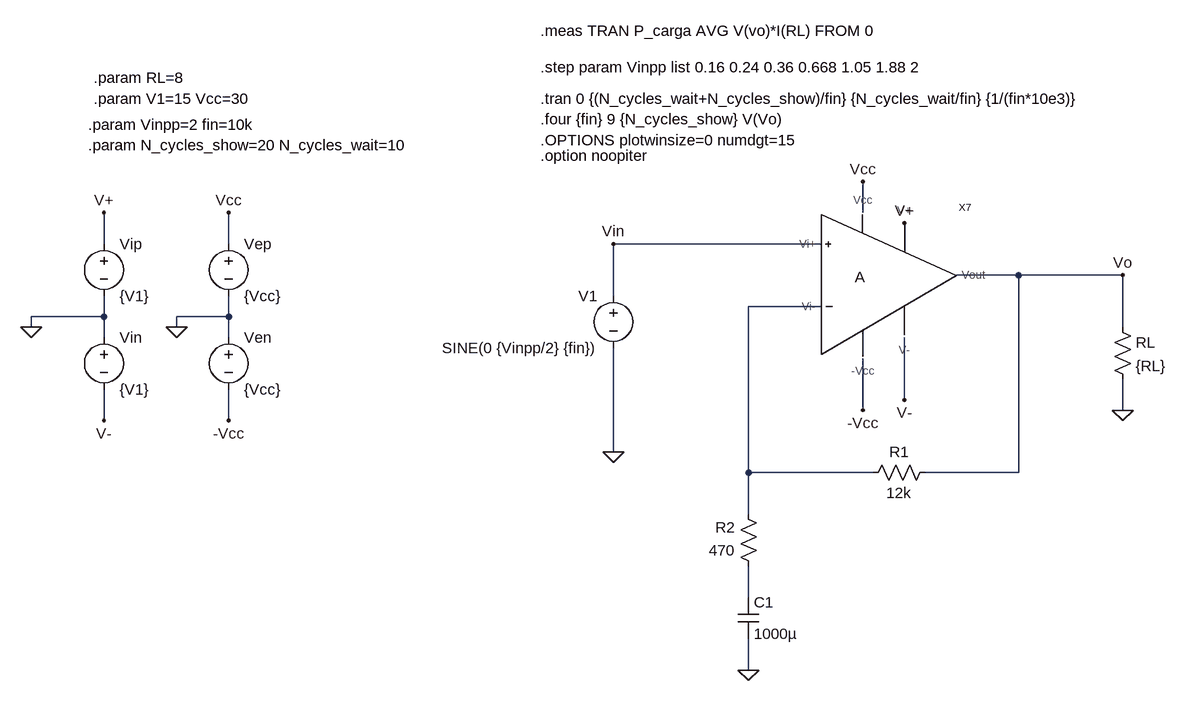
[diagram p0: schematic thd.asc]
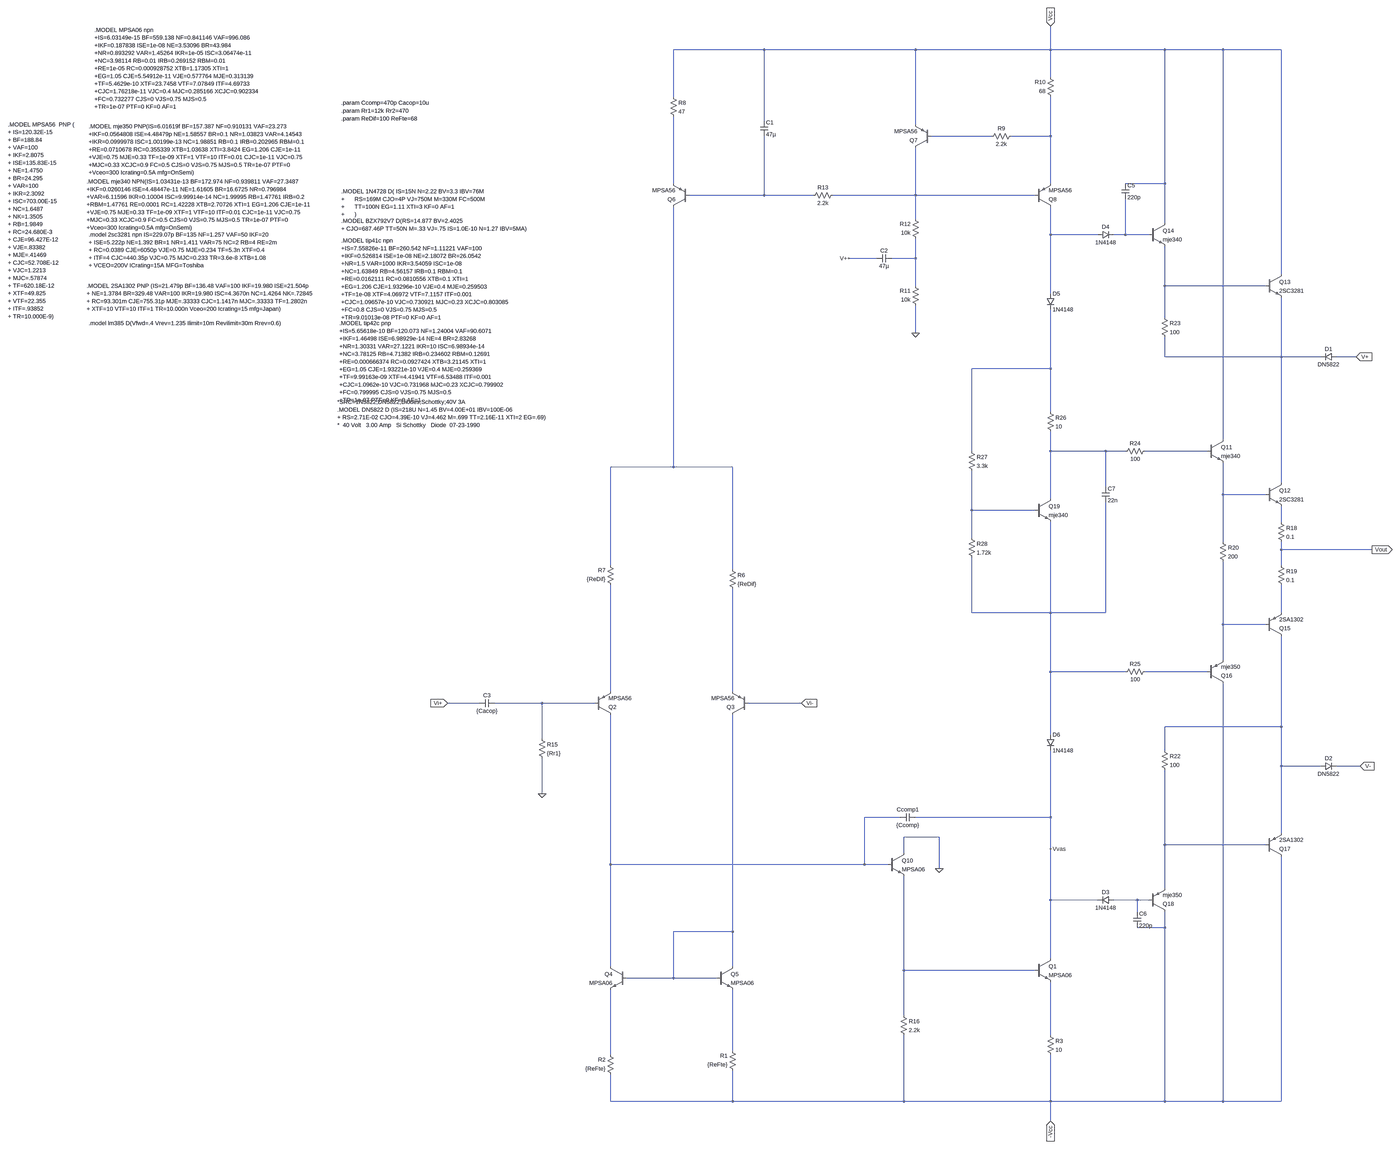
[diagram p1: sub-circuit amplificador.asc, whole sheet]
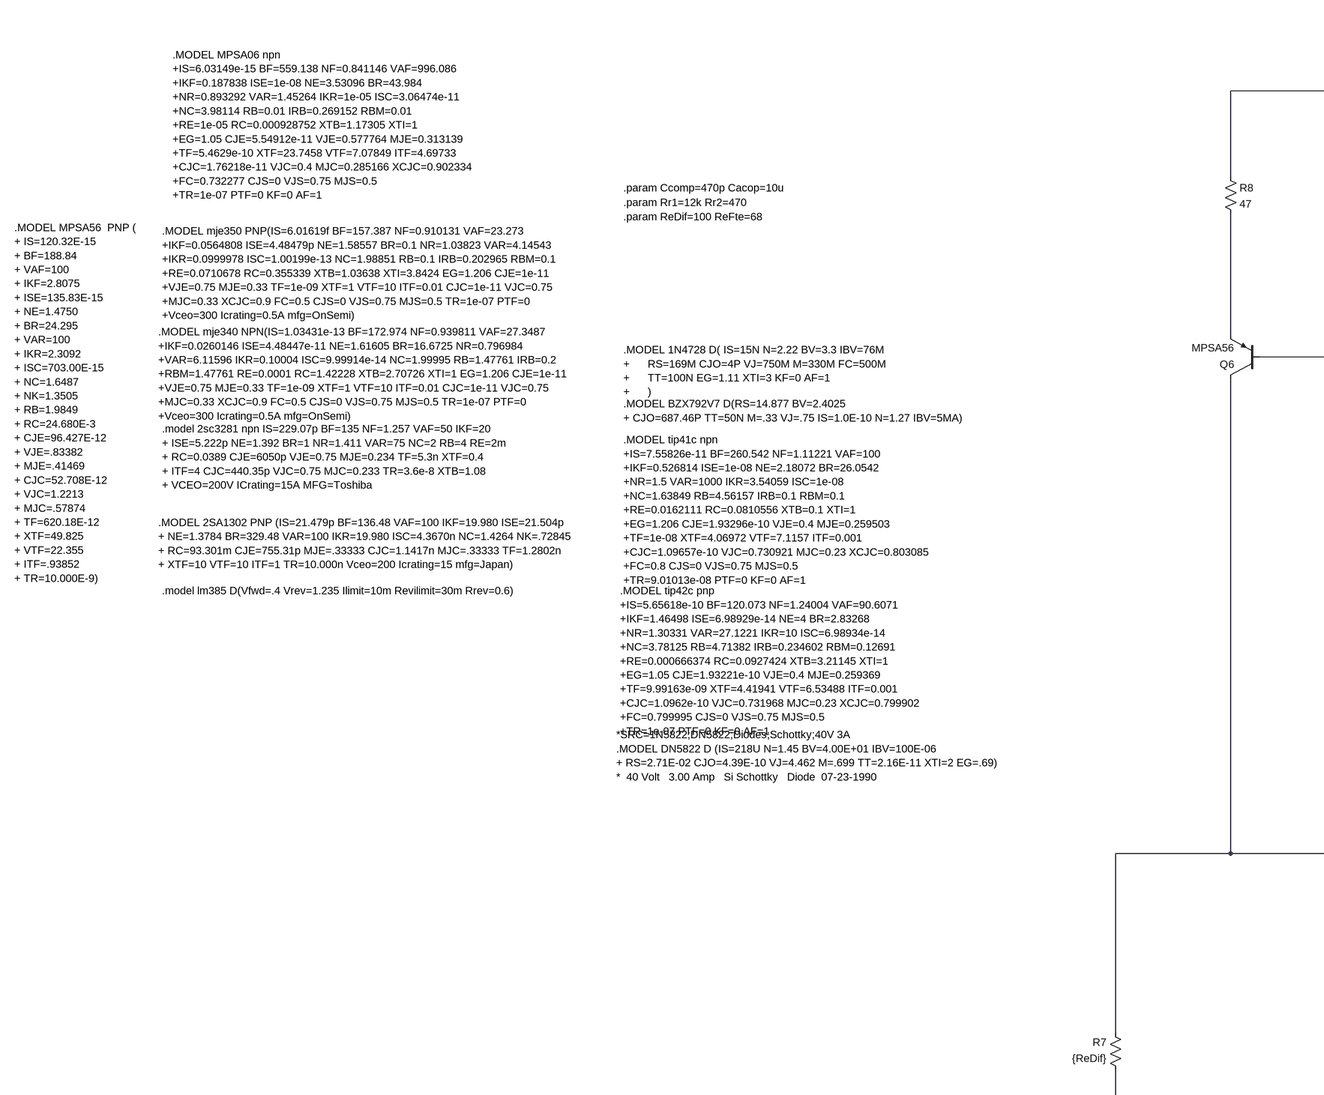
[diagram p2: sub-circuit amplificador.asc, part, row 1 of 2, column 1 of 2]
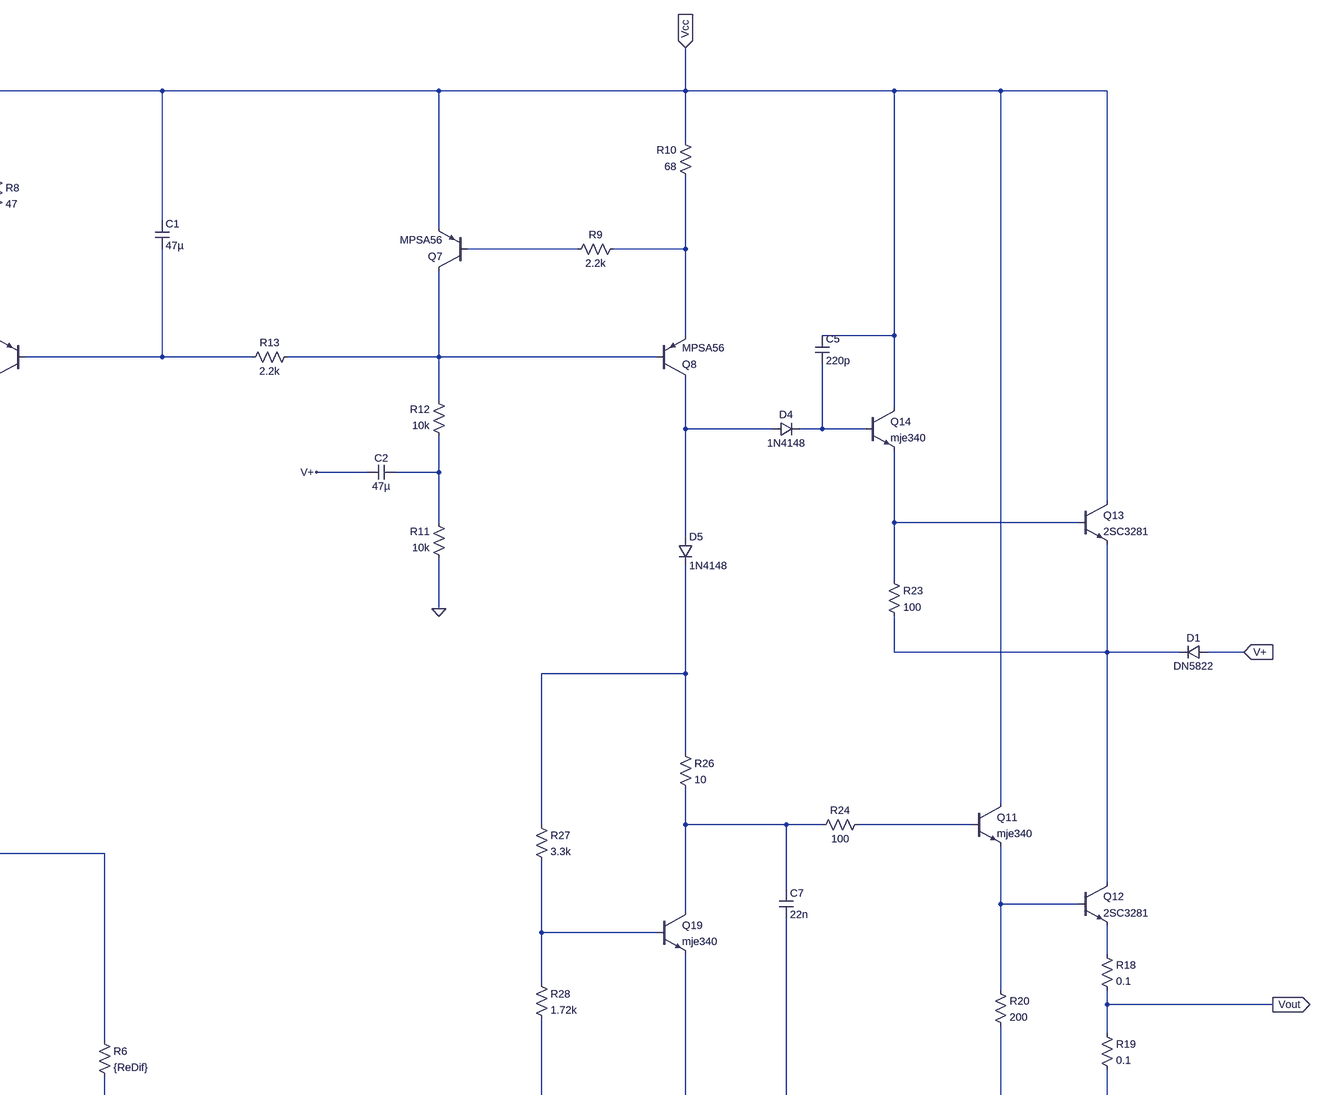
[diagram p3: sub-circuit amplificador.asc, part, row 1 of 2, column 2 of 2]
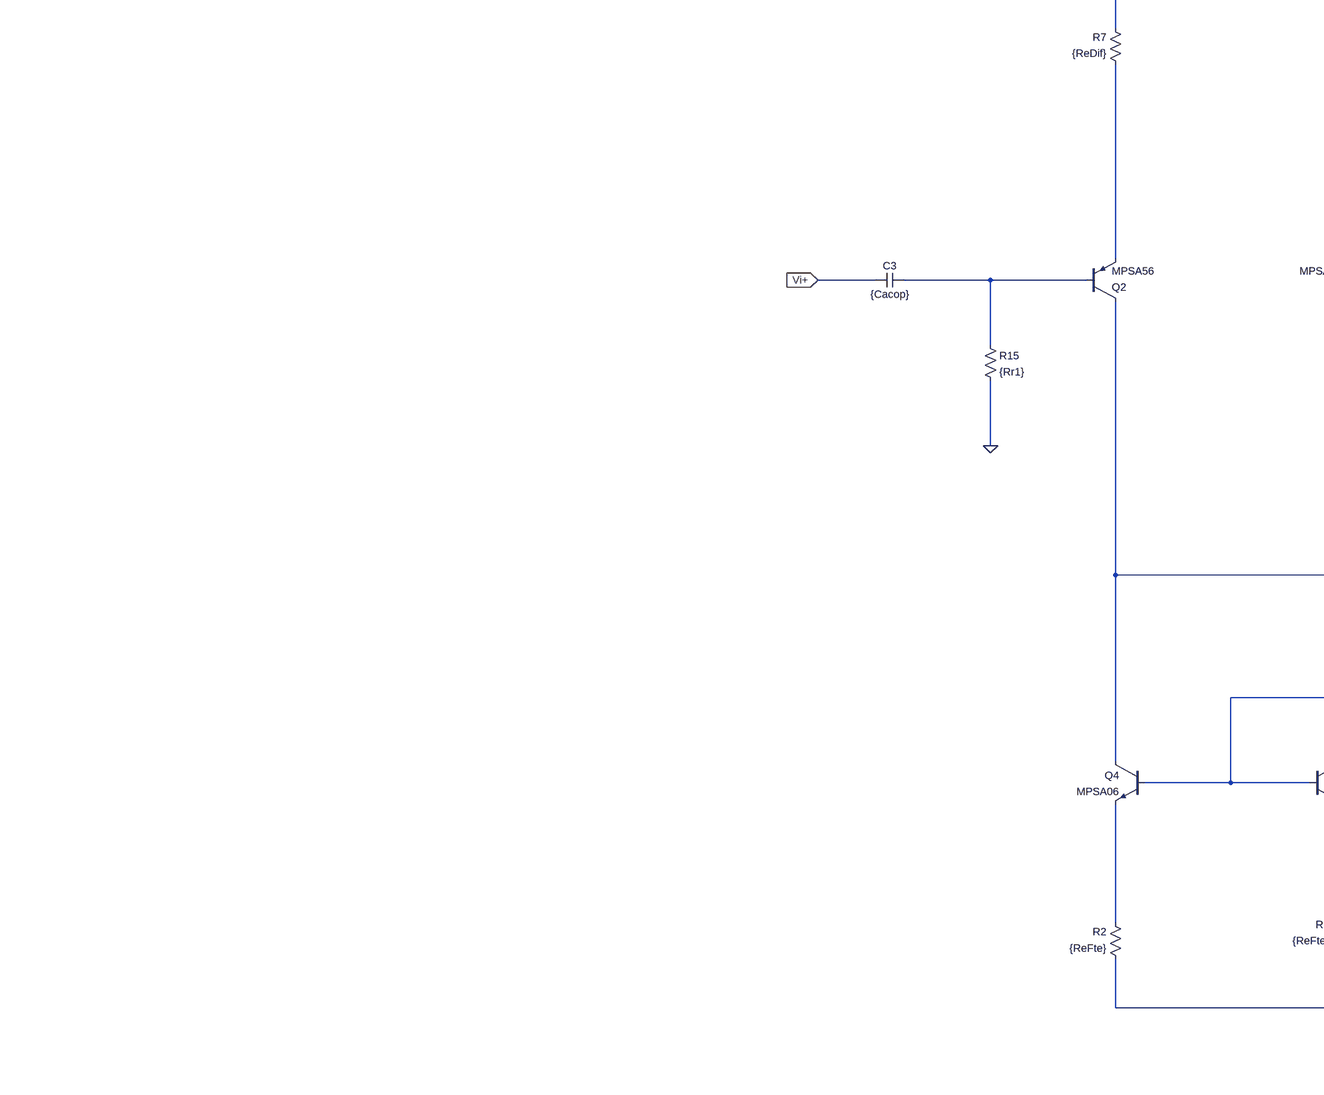
[diagram p4: sub-circuit amplificador.asc, part, row 2 of 2, column 1 of 2]
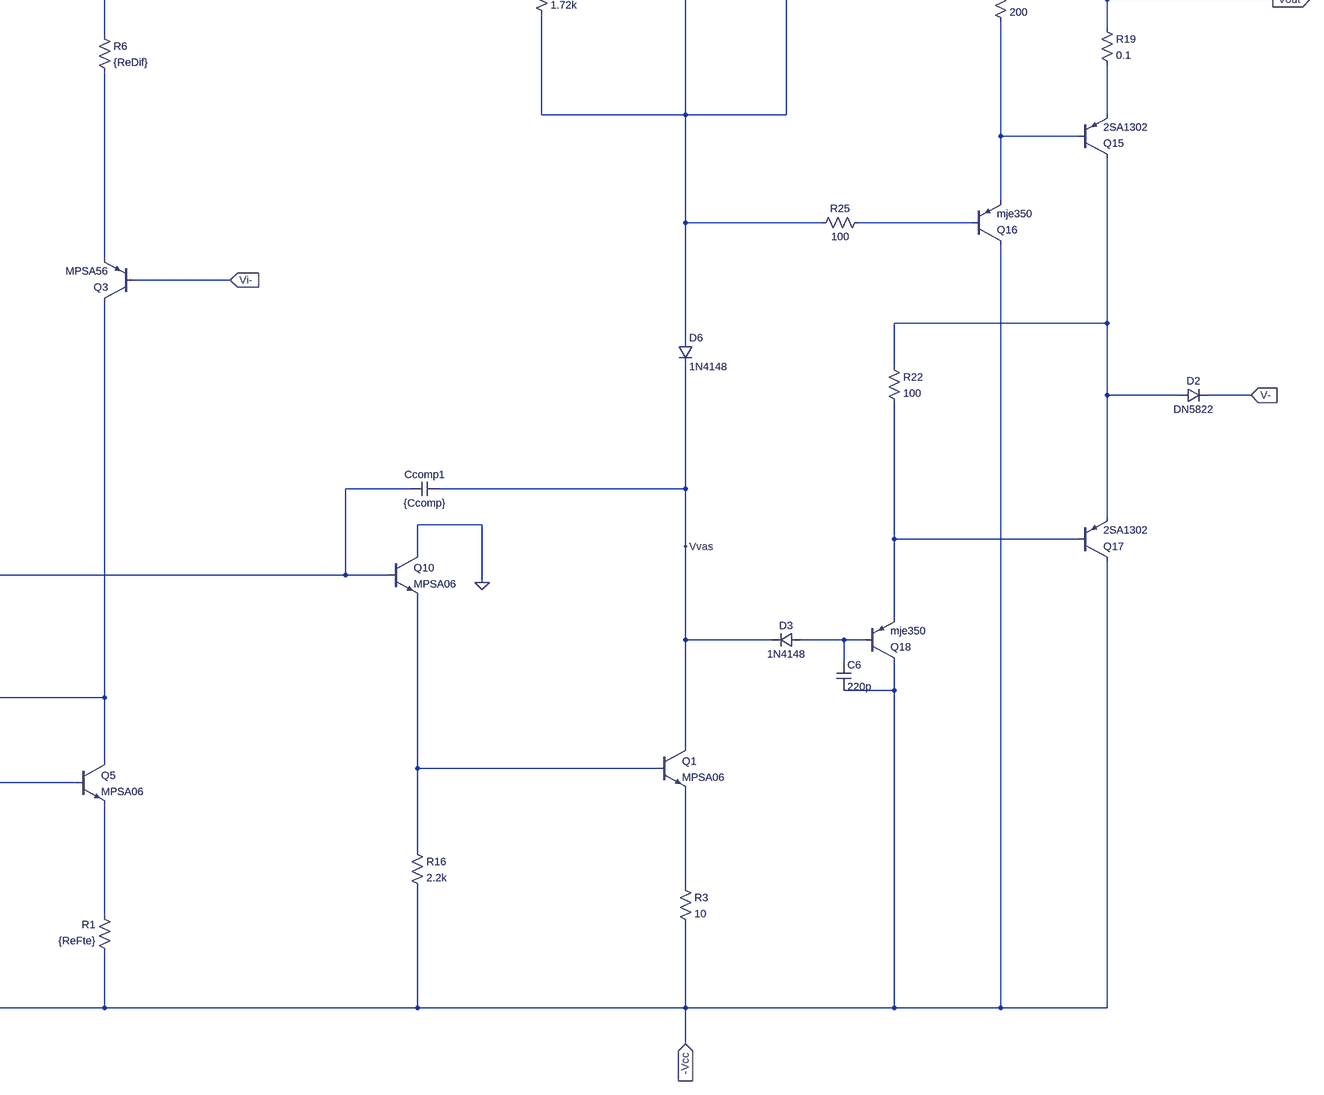
[diagram p5: sub-circuit amplificador.asc, part, row 2 of 2, column 2 of 2]
thd.asc, the LTspice schematic file:
Version 4
SHEET 1 2388 1476
WIRE -256 320 -256 272
WIRE -1424 368 -1424 320
WIRE -1232 368 -1232 320
WIRE -320 368 -640 368
WIRE -16 416 -112 416
WIRE 144 416 -16 416
WIRE -640 448 -640 368
WIRE -320 464 -432 464
WIRE -1424 480 -1424 448
WIRE -1424 480 -1536 480
WIRE -1232 480 -1232 448
WIRE -1232 480 -1312 480
WIRE -1536 496 -1536 480
WIRE -1312 496 -1312 480
WIRE 144 496 144 416
WIRE -1424 512 -1424 480
WIRE -1232 512 -1232 480
WIRE -192 608 -192 512
WIRE -256 624 -256 544
WIRE 144 624 144 576
WIRE -1424 640 -1424 592
WIRE -1232 640 -1232 592
WIRE -640 688 -640 528
WIRE -432 720 -432 464
WIRE -240 720 -432 720
WIRE -16 720 -16 416
WIRE -16 720 -160 720
WIRE -432 784 -432 720
WIRE -432 912 -432 864
WIRE -432 1024 -432 976
FLAG -256 272 Vcc
FLAG -256 624 -Vcc
FLAG -192 608 V-
FLAG -1536 496 0
FLAG -1312 496 0
FLAG -1232 640 -Vcc
FLAG -1232 320 Vcc
FLAG -640 688 0
FLAG -640 368 Vin
FLAG 144 624 0
FLAG -192 336 V+
FLAG -1424 320 V+
FLAG -1424 640 V-
FLAG 144 416 Vo
FLAG -432 1024 0
SYMBOL amplificador -256 416 R0
SYMATTR InstName X7
SYMBOL res -144 704 R90
WINDOW 0 0 56 VBottom 2
WINDOW 3 32 56 VTop 2
SYMATTR InstName R1
SYMATTR Value 12k
SYMBOL res -416 880 R180
WINDOW 0 36 76 Left 2
WINDOW 3 36 40 Left 2
SYMATTR InstName R2
SYMATTR Value 470
SYMBOL voltage -1424 352 R0
WINDOW 123 0 0 Left 2
WINDOW 39 0 0 Left 2
SYMATTR InstName Vip
SYMATTR Value {V1}
SYMBOL voltage -1424 496 R0
WINDOW 123 0 0 Left 2
WINDOW 39 0 0 Left 2
SYMATTR InstName Vin
SYMATTR Value {V1}
SYMBOL voltage -1232 352 R0
WINDOW 123 0 0 Left 2
WINDOW 39 0 0 Left 2
SYMATTR InstName Vep
SYMATTR Value {Vcc}
SYMBOL voltage -1232 496 R0
WINDOW 123 0 0 Left 2
WINDOW 39 0 0 Left 2
SYMATTR InstName Ven
SYMATTR Value {Vcc}
SYMBOL voltage -640 432 M0
WINDOW 123 0 0 Left 2
WINDOW 39 0 0 Left 2
SYMATTR InstName V1
SYMATTR Value SINE(0 {Vinpp/2} {fin})
SYMBOL res 128 480 R0
SYMATTR InstName RL
SYMATTR Value {RL}
SYMBOL cap -448 912 R0
SYMATTR InstName C1
SYMATTR Value 1000µ
TEXT -1448 216 Left 2 !.param N_cycles_show=20 N_cycles_wait=10
TEXT -1448 184 Left 2 !.param Vinpp=2 fin=10k
TEXT -1440 144 Left 2 !.param V1=15 Vcc=30
TEXT -1440 112 Left 2 !.param RL=8
TEXT -752 96 Left 2 !.step param Vinpp list 0.16 0.24 0.36 0.668 1.05 1.88 2
TEXT -752 144 Left 2 !.tran 0 {(N_cycles_wait+N_cycles_show)/fin} {N_cycles_wait/fin} {1/(fin*10e3)}
TEXT -752 176 Left 2 !.four {fin} 9 {N_cycles_show} V(Vo)
TEXT -752 208 Left 2 !.OPTIONS plotwinsize=0 numdgt=15
TEXT -752 232 Left 2 !.option noopiter
TEXT -752 40 Left 2 !.meas TRAN P_carga AVG V(vo)*I(RL) FROM 0

amplificador.asc, the sub-circuit schematic file:
Version 4
SHEET 1 7264 2156
WIRE -1120 -2688 -1488 -2688
WIRE -368 -2688 -1120 -2688
WIRE 192 -2688 192 -2784
WIRE 192 -2688 -368 -2688
WIRE 656 -2688 192 -2688
WIRE 976 -2688 656 -2688
WIRE 1296 -2688 976 -2688
WIRE 192 -2576 192 -2688
WIRE -1488 -2496 -1488 -2688
WIRE -1120 -2400 -1120 -2688
WIRE -368 -2384 -368 -2688
WIRE -48 -2336 -304 -2336
WIRE 192 -2336 192 -2496
WIRE 192 -2336 32 -2336
WIRE -1488 -2144 -1488 -2416
WIRE 192 -2144 192 -2336
WIRE 656 -2144 656 -2688
WIRE 656 -2144 496 -2144
WIRE -1120 -2096 -1120 -2336
WIRE -1120 -2096 -1424 -2096
WIRE -784 -2096 -1120 -2096
WIRE -368 -2096 -368 -2288
WIRE -368 -2096 -704 -2096
WIRE 128 -2096 -368 -2096
WIRE -368 -2000 -368 -2096
WIRE 656 -1984 656 -2144
WIRE 192 -1936 192 -2048
WIRE 384 -1936 192 -1936
WIRE 496 -1936 496 -2080
WIRE 496 -1936 448 -1936
WIRE 592 -1936 496 -1936
WIRE -528 -1840 -640 -1840
WIRE -368 -1840 -368 -1920
WIRE -368 -1840 -464 -1840
WIRE 1296 -1776 1296 -2688
WIRE -368 -1728 -368 -1840
WIRE 656 -1728 656 -1888
WIRE 1232 -1728 656 -1728
WIRE 192 -1696 192 -1936
WIRE 656 -1600 656 -1728
WIRE -368 -1536 -368 -1648
WIRE 656 -1440 656 -1520
WIRE 1296 -1440 1296 -1680
WIRE 1296 -1440 656 -1440
WIRE 1456 -1440 1296 -1440
WIRE 1600 -1440 1520 -1440
WIRE 192 -1392 192 -1632
WIRE 192 -1392 -128 -1392
WIRE 192 -1216 192 -1392
WIRE 976 -1104 976 -2688
WIRE -128 -1056 -128 -1392
WIRE 192 -1056 192 -1136
WIRE 416 -1056 192 -1056
WIRE 496 -1056 416 -1056
WIRE 912 -1056 576 -1056
WIRE -1488 -992 -1488 -2048
WIRE -1488 -992 -1744 -992
WIRE -1248 -992 -1488 -992
WIRE 1296 -928 1296 -1440
WIRE 416 -912 416 -1056
WIRE 976 -880 976 -1008
WIRE 1232 -880 976 -880
WIRE 192 -864 192 -1056
WIRE -128 -816 -128 -976
WIRE 128 -816 -128 -816
WIRE 1296 -768 1296 -832
WIRE -128 -704 -128 -816
WIRE 976 -688 976 -880
WIRE 1296 -656 1296 -688
WIRE 1664 -656 1296 -656
WIRE -1744 -592 -1744 -992
WIRE 1296 -592 1296 -656
WIRE -1248 -576 -1248 -992
WIRE -128 -400 -128 -624
WIRE 192 -400 192 -768
WIRE 192 -400 -128 -400
WIRE 416 -400 416 -848
WIRE 416 -400 192 -400
WIRE 1296 -400 1296 -512
WIRE 976 -352 976 -608
WIRE 1232 -352 976 -352
WIRE 976 -208 976 -352
WIRE 192 -160 192 -400
WIRE 496 -160 192 -160
WIRE 912 -160 576 -160
WIRE -1744 -80 -1744 -512
WIRE -1248 -80 -1248 -496
WIRE -2288 -32 -2416 -32
WIRE -2032 -32 -2224 -32
WIRE -1808 -32 -2032 -32
WIRE -832 -32 -1184 -32
WIRE 1296 64 1296 -304
WIRE 1296 64 656 64
WIRE 192 96 192 -160
WIRE -2032 112 -2032 -32
WIRE 656 160 656 64
WIRE 1296 224 1296 64
WIRE 1456 224 1296 224
WIRE 1616 224 1520 224
WIRE -2032 336 -2032 192
WIRE -432 432 -576 432
WIRE 192 432 192 160
WIRE 192 432 -368 432
WIRE 1296 496 1296 224
WIRE -272 512 -416 512
WIRE 656 544 656 240
WIRE 1232 544 656 544
WIRE 192 560 192 432
WIRE -416 576 -416 512
WIRE -1744 624 -1744 16
WIRE -576 624 -576 432
WIRE -576 624 -1744 624
WIRE -480 624 -576 624
WIRE -272 640 -272 512
WIRE 656 720 656 544
WIRE 192 768 192 560
WIRE 384 768 192 768
WIRE 544 768 448 768
WIRE 592 768 544 768
WIRE 544 816 544 768
WIRE 656 880 656 816
WIRE 656 880 544 880
WIRE -1248 896 -1248 16
WIRE -1248 896 -1488 896
WIRE 192 1024 192 768
WIRE -1744 1056 -1744 624
WIRE -1248 1056 -1248 896
WIRE -416 1072 -416 672
WIRE 128 1072 -416 1072
WIRE -1488 1104 -1488 896
WIRE -1488 1104 -1680 1104
WIRE -1312 1104 -1488 1104
WIRE -416 1264 -416 1072
WIRE 192 1344 192 1120
WIRE -1248 1408 -1248 1152
WIRE -1744 1424 -1744 1152
WIRE -1744 1728 -1744 1504
WIRE -1248 1728 -1248 1488
WIRE -1248 1728 -1744 1728
WIRE -416 1728 -416 1344
WIRE -416 1728 -1248 1728
WIRE 192 1728 192 1424
WIRE 192 1728 -416 1728
WIRE 656 1728 656 880
WIRE 656 1728 192 1728
WIRE 976 1728 976 -112
WIRE 976 1728 656 1728
WIRE 1296 1728 1296 592
WIRE 1296 1728 976 1728
WIRE 192 1808 192 1728
FLAG -368 -1536 0
FLAG -640 -1840 V+
FLAG -2032 336 0
FLAG -272 640 0
FLAG 192 560 Vvas
FLAG -2416 -32 Vi+
IOPIN -2416 -32 In
FLAG -832 -32 Vi-
IOPIN -832 -32 In
FLAG 192 -2784 Vcc
IOPIN 192 -2784 In
FLAG 192 1808 -Vcc
IOPIN 192 1808 In
FLAG 1664 -656 Vout
IOPIN 1664 -656 Out
FLAG 1616 224 V-
IOPIN 1616 224 In
FLAG 1600 -1440 V+
IOPIN 1600 -1440 In
DATAFLAG -1488 -992 ""
DATAFLAG 192 -160 ""
DATAFLAG 192 -1392 ""
DATAFLAG 192 -1056 ""
DATAFLAG 800 -1056 ""
DATAFLAG 784 -160 ""
DATAFLAG 976 -880 ""
DATAFLAG 192 -1936 ""
DATAFLAG 192 -2688 ""
DATAFLAG 544 -1936 ""
DATAFLAG -2032 -32 ""
DATAFLAG -1488 -1696 "Ic(Q6)"
DATAFLAG -1744 -768 "-I(R7)"
DATAFLAG -1248 -768 "I(R6)"
DATAFLAG -1744 192 "-Ic(Q2)"
DATAFLAG -1248 176 "-Ic(Q3)"
DATAFLAG -1744 1296 ""
DATAFLAG -1248 1296 ""
DATAFLAG -1744 624 ""
DATAFLAG -1248 896 ""
DATAFLAG -416 1072 ""
DATAFLAG -416 832 "Ic(Q10)"
DATAFLAG 192 432 ""
DATAFLAG 192 752 "Ic(Q1)"
DATAFLAG 192 1248 ""
DATAFLAG 192 1552 "I(R3)"
DATAFLAG -1488 -2288 ""
DATAFLAG 192 -2352 ""
DATAFLAG -368 -2096 ""
DATAFLAG -1136 -2096 ""
DATAFLAG 976 -352 ""
DATAFLAG 512 768 ""
DATAFLAG 1456 -544 "V(Vo)-V(n019)"
DATAFLAG 1200 -768 "I(R18)"
DATAFLAG 864 -640 "I(R20)"
DATAFLAG 1200 -496 "I(R19)"
DATAFLAG 1472 -720 "-(V(Vo)-V(n017))"
DATAFLAG 1120 -640 "V(n015)-V(n020)"
DATAFLAG 1536 -320 "V(n019)-V(n026)"
DATAFLAG 1472 -864 "V(n010)-V(n027)"
DATAFLAG 1312 -1440 ""
DATAFLAG 1488 -1504 "V(V1+)-V(n010)"
DATAFLAG 1488 160 "-(V(V1-)-V(n026))"
DATAFLAG 656 544 ""
DATAFLAG 656 -1728 ""
SYMBOL res -1232 1504 R180
WINDOW 0 36 76 Left 2
WINDOW 3 36 40 Left 2
SYMATTR InstName R1
SYMATTR Value {ReFte}
SYMBOL res -1728 1520 R180
WINDOW 0 36 76 Left 2
WINDOW 3 36 40 Left 2
SYMATTR InstName R2
SYMATTR Value {ReFte}
SYMBOL npn 128 1024 R0
SYMATTR InstName Q1
SYMATTR Value MPSA06
SYMBOL res 176 1328 R0
SYMATTR InstName R3
SYMATTR Value 10
SYMBOL pnp -1808 16 M180
SYMATTR InstName Q2
SYMATTR Value MPSA56
SYMBOL pnp -1184 16 R180
SYMATTR InstName Q3
SYMATTR Value MPSA56
SYMBOL npn -1680 1056 M0
SYMATTR InstName Q4
SYMATTR Value MPSA06
SYMBOL npn -1312 1056 R0
SYMATTR InstName Q5
SYMATTR Value MPSA06
SYMBOL res -1264 -592 R0
SYMATTR InstName R6
SYMATTR Value {ReDif}
SYMBOL res -1728 -496 R180
WINDOW 0 36 76 Left 2
WINDOW 3 36 40 Left 2
SYMATTR InstName R7
SYMATTR Value {ReDif}
SYMBOL pnp -1424 -2048 R180
SYMATTR InstName Q6
SYMATTR Value MPSA56
SYMBOL pnp -304 -2288 R180
SYMATTR InstName Q7
SYMATTR Value MPSA56
SYMBOL pnp 128 -2048 M180
SYMATTR InstName Q8
SYMATTR Value MPSA56
SYMBOL cap -1136 -2400 R0
SYMATTR InstName C1
SYMATTR Value 47µ
SYMBOL cap -528 -1824 R270
WINDOW 0 32 32 VTop 2
WINDOW 3 0 32 VBottom 2
SYMATTR InstName C2
SYMATTR Value 47µ
SYMBOL res -1504 -2512 R0
SYMATTR InstName R8
SYMATTR Value 47
SYMBOL res 48 -2352 R90
WINDOW 0 0 56 VBottom 2
WINDOW 3 32 56 VTop 2
SYMATTR InstName R9
SYMATTR Value 2.2k
SYMBOL res 208 -2480 R180
WINDOW 0 36 76 Left 2
WINDOW 3 36 40 Left 2
SYMATTR InstName R10
SYMATTR Value 68
SYMBOL res -352 -1632 R180
WINDOW 0 36 76 Left 2
WINDOW 3 36 40 Left 2
SYMATTR InstName R11
SYMATTR Value 10k
SYMBOL res -352 -1904 R180
WINDOW 0 36 76 Left 2
WINDOW 3 36 40 Left 2
SYMATTR InstName R12
SYMATTR Value 10k
SYMBOL res -800 -2080 R270
WINDOW 0 32 56 VTop 2
WINDOW 3 0 56 VBottom 2
SYMATTR InstName R13
SYMATTR Value 2.2k
SYMBOL res -2048 96 R0
SYMATTR InstName R15
SYMATTR Value {Rr1}
SYMBOL cap -2224 -48 R90
WINDOW 0 0 32 VBottom 2
WINDOW 3 32 32 VTop 2
SYMATTR InstName C3
SYMATTR Value {Cacop}
SYMBOL npn -480 576 R0
SYMATTR InstName Q10
SYMATTR Value MPSA06
SYMBOL res -432 1248 R0
SYMATTR InstName R16
SYMATTR Value 2.2k
SYMBOL cap -368 416 R90
WINDOW 0 0 32 VBottom 2
WINDOW 3 32 32 VTop 2
SYMATTR InstName Ccomp1
SYMATTR Value {Ccomp}
SYMBOL npn 912 -1104 R0
SYMATTR InstName Q11
SYMATTR Value mje340
SYMBOL npn 1232 -928 R0
SYMATTR InstName Q12
SYMATTR Value 2SC3281
SYMBOL npn 1232 -1776 R0
SYMATTR InstName Q13
SYMATTR Value 2SC3281
SYMBOL npn 592 -1984 R0
SYMATTR InstName Q14
SYMATTR Value mje340
SYMBOL res 1280 -784 R0
SYMATTR InstName R18
SYMATTR Value 0.1
SYMBOL res 1280 -608 R0
SYMATTR InstName R19
SYMATTR Value 0.1
SYMBOL pnp 1232 -304 M180
SYMATTR InstName Q15
SYMATTR Value 2SA1302
SYMBOL pnp 912 -112 M180
SYMATTR InstName Q16
SYMATTR Value mje350
SYMBOL pnp 1232 592 M180
SYMATTR InstName Q17
SYMATTR Value 2SA1302
SYMBOL pnp 592 816 M180
SYMATTR InstName Q18
SYMATTR Value mje350
SYMBOL res 960 -704 R0
SYMATTR InstName R20
SYMATTR Value 200
SYMBOL res 640 144 R0
SYMATTR InstName R22
SYMATTR Value 100
SYMBOL res 640 -1616 R0
SYMATTR InstName R23
SYMATTR Value 100
SYMBOL diode 448 752 R90
WINDOW 0 0 32 VBottom 2
WINDOW 3 32 32 VTop 2
SYMATTR InstName D3
SYMATTR Value 1N4148
SYMBOL diode 384 -1920 R270
WINDOW 0 32 32 VTop 2
WINDOW 3 0 32 VBottom 2
SYMATTR InstName D4
SYMATTR Value 1N4148
SYMBOL npn 128 -864 R0
SYMATTR InstName Q19
SYMATTR Value mje340
SYMBOL res 592 -1072 R90
WINDOW 0 0 56 VBottom 2
WINDOW 3 32 56 VTop 2
SYMATTR InstName R24
SYMATTR Value 100
SYMBOL res 592 -176 R90
WINDOW 0 0 56 VBottom 2
WINDOW 3 32 56 VTop 2
SYMATTR InstName R25
SYMATTR Value 100
SYMBOL res 176 -1232 R0
SYMATTR InstName R26
SYMATTR Value 10
SYMBOL res -144 -1072 R0
SYMATTR InstName R27
SYMATTR Value 3.3k
SYMBOL res -144 -720 R0
SYMATTR InstName R28
SYMATTR Value 1.72k
SYMBOL cap 400 -912 R0
SYMATTR InstName C7
SYMATTR Value 22n
SYMBOL diode 176 -1696 R0
SYMATTR InstName D5
SYMATTR Value 1N4148
SYMBOL diode 176 96 R0
SYMATTR InstName D6
SYMATTR Value 1N4148
SYMBOL diode 1520 -1456 R90
WINDOW 0 0 32 VBottom 2
WINDOW 3 32 32 VTop 2
SYMATTR InstName D1
SYMATTR Value DN5822
SYMBOL diode 1456 240 R270
WINDOW 0 32 32 VTop 2
WINDOW 3 0 32 VBottom 2
SYMATTR InstName D2
SYMATTR Value DN5822
SYMBOL cap 480 -2144 R0
SYMATTR InstName C5
SYMATTR Value 220p
SYMBOL cap 528 816 R0
SYMATTR InstName C6
SYMATTR Value 220p
TEXT -2848 -2408 Left 2 !.param ReDif=100 ReFte=68
TEXT -2848 -2440 Left 2 !.param Rr1=12k Rr2=470
TEXT -2848 -2472 Left 2 !.param Ccomp=470p Cacop=10u
TEXT -2848 -2112 Left 2 !.MODEL 1N4728 D( IS=15N N=2.22 BV=3.3 IBV=76M \n+      RS=169M CJO=4P VJ=750M M=330M FC=500M \n+      TT=100N EG=1.11 XTI=3 KF=0 AF=1 \n+      )
TEXT -2848 -1992 Left 2 !.MODEL BZX792V7 D(RS=14.877 BV=2.4025  \n+ CJO=687.46P TT=50N M=.33 VJ=.75 IS=1.0E-10 N=1.27 IBV=5MA)
TEXT -2848 -1912 Left 2 !.MODEL tip41c npn\n+IS=7.55826e-11 BF=260.542 NF=1.11221 VAF=100\n+IKF=0.526814 ISE=1e-08 NE=2.18072 BR=26.0542\n+NR=1.5 VAR=1000 IKR=3.54059 ISC=1e-08\n+NC=1.63849 RB=4.56157 IRB=0.1 RBM=0.1\n+RE=0.0162111 RC=0.0810556 XTB=0.1 XTI=1\n+EG=1.206 CJE=1.93296e-10 VJE=0.4 MJE=0.259503\n+TF=1e-08 XTF=4.06972 VTF=7.1157 ITF=0.001\n+CJC=1.09657e-10 VJC=0.730921 MJC=0.23 XCJC=0.803085\n+FC=0.8 CJS=0 VJS=0.75 MJS=0.5\n+TR=9.01013e-08 PTF=0 KF=0 AF=1
TEXT -2856 -1576 Left 2 !.MODEL tip42c pnp\n+IS=5.65618e-10 BF=120.073 NF=1.24004 VAF=90.6071\n+IKF=1.46498 ISE=6.98929e-14 NE=4 BR=2.83268\n+NR=1.30331 VAR=27.1221 IKR=10 ISC=6.98934e-14\n+NC=3.78125 RB=4.71382 IRB=0.234602 RBM=0.12691\n+RE=0.000666374 RC=0.0927424 XTB=3.21145 XTI=1\n+EG=1.05 CJE=1.93221e-10 VJE=0.4 MJE=0.259369\n+TF=9.99163e-09 XTF=4.41941 VTF=6.53488 ITF=0.001\n+CJC=1.0962e-10 VJC=0.731968 MJC=0.23 XCJC=0.799902\n+FC=0.799995 CJS=0 VJS=0.75 MJS=0.5\n+TR=1e-07 PTF=0 KF=0 AF=1
TEXT -2864 -1256 Left 2 !*SRC=1N5822;DN5822;Diodes;Schottky;40V 3A\n.MODEL DN5822 D (IS=218U N=1.45 BV=4.00E+01 IBV=100E-06\n+ RS=2.71E-02 CJO=4.39E-10 VJ=4.462 M=.699 TT=2.16E-11 XTI=2 EG=.69)\n*  40 Volt   3.00 Amp   Si Schottky   Diode  07-23-1990
TEXT -4056 -1936 Left 2 !.model 2sc3281 npn IS=229.07p BF=135 NF=1.257 VAF=50 IKF=20\n+ ISE=5.222p NE=1.392 BR=1 NR=1.411 VAR=75 NC=2 RB=4 RE=2m\n+ RC=0.0389 CJE=6050p VJE=0.75 MJE=0.234 TF=5.3n XTF=0.4\n+ ITF=4 CJC=440.35p VJC=0.75 MJC=0.233 TR=3.6e-8 XTB=1.08\n+ VCEO=200V ICrating=15A MFG=Toshiba
TEXT -4064 -1728 Left 2 !.MODEL 2SA1302 PNP (IS=21.479p BF=136.48 VAF=100 IKF=19.980 ISE=21.504p\n+ NE=1.3784 BR=329.48 VAR=100 IKR=19.980 ISC=4.3670n NC=1.4264 NK=.72845\n+ RC=93.301m CJE=755.31p MJE=.33333 CJC=1.1417n MJC=.33333 TF=1.2802n\n+ XTF=10 VTF=10 ITF=1 TR=10.000n Vceo=200 Icrating=15 mfg=Japan)
TEXT -4064 -2152 Left 2 !.MODEL mje340 NPN(IS=1.03431e-13 BF=172.974 NF=0.939811 VAF=27.3487\n+IKF=0.0260146 ISE=4.48447e-11 NE=1.61605 BR=16.6725 NR=0.796984\n+VAR=6.11596 IKR=0.10004 ISC=9.99914e-14 NC=1.99995 RB=1.47761 IRB=0.2\n+RBM=1.47761 RE=0.0001 RC=1.42228 XTB=2.70726 XTI=1 EG=1.206 CJE=1e-11\n+VJE=0.75 MJE=0.33 TF=1e-09 XTF=1 VTF=10 ITF=0.01 CJC=1e-11 VJC=0.75\n+MJC=0.33 XCJC=0.9 FC=0.5 CJS=0 VJS=0.75 MJS=0.5 TR=1e-07 PTF=0\n+Vceo=300 Icrating=0.5A mfg=OnSemi)
TEXT -4056 -2376 Left 2 !.MODEL mje350 PNP(IS=6.01619f BF=157.387 NF=0.910131 VAF=23.273\n+IKF=0.0564808 ISE=4.48479p NE=1.58557 BR=0.1 NR=1.03823 VAR=4.14543\n+IKR=0.0999978 ISC=1.00199e-13 NC=1.98851 RB=0.1 IRB=0.202965 RBM=0.1\n+RE=0.0710678 RC=0.355339 XTB=1.03638 XTI=3.8424 EG=1.206 CJE=1e-11\n+VJE=0.75 MJE=0.33 TF=1e-09 XTF=1 VTF=10 ITF=0.01 CJC=1e-11 VJC=0.75\n+MJC=0.33 XCJC=0.9 FC=0.5 CJS=0 VJS=0.75 MJS=0.5 TR=1e-07 PTF=0\n+Vceo=300 Icrating=0.5A mfg=OnSemi)
TEXT -4384 -2384 Left 2 !.MODEL MPSA56  PNP (\n+ IS=120.32E-15\n+ BF=188.84\n+ VAF=100\n+ IKF=2.8075\n+ ISE=135.83E-15\n+ NE=1.4750\n+ BR=24.295\n+ VAR=100\n+ IKR=2.3092\n+ ISC=703.00E-15\n+ NC=1.6487\n+ NK=1.3505\n+ RB=1.9849\n+ RC=24.680E-3\n+ CJE=96.427E-12\n+ VJE=.83382\n+ MJE=.41469\n+ CJC=52.708E-12\n+ VJC=1.2213\n+ MJC=.57874\n+ TF=620.18E-12\n+ XTF=49.825\n+ VTF=22.355\n+ ITF=.93852\n+ TR=10.000E-9)
TEXT -4032 -2768 Left 2 !.MODEL MPSA06 npn\n+IS=6.03149e-15 BF=559.138 NF=0.841146 VAF=996.086\n+IKF=0.187838 ISE=1e-08 NE=3.53096 BR=43.984\n+NR=0.893292 VAR=1.45264 IKR=1e-05 ISC=3.06474e-11\n+NC=3.98114 RB=0.01 IRB=0.269152 RBM=0.01\n+RE=1e-05 RC=0.000928752 XTB=1.17305 XTI=1\n+EG=1.05 CJE=5.54912e-11 VJE=0.577764 MJE=0.313139\n+TF=5.4629e-10 XTF=23.7458 VTF=7.07849 ITF=4.69733\n+CJC=1.76218e-11 VJC=0.4 MJC=0.285166 XCJC=0.902334\n+FC=0.732277 CJS=0 VJS=0.75 MJS=0.5\n+TR=1e-07 PTF=0 KF=0 AF=1
TEXT -4056 -1576 Left 2 !.model lm385 D(Vfwd=.4 Vrev=1.235 Ilimit=10m Revilimit=30m Rrev=0.6)

The netlist it stands for:
* thd.asc
XX7 Vin Vcc -Vcc Vo N001 V- V+ amplificador
R1 Vo N001 12k
R2 N002 N001 470
Vip V+ 0 {V1}
Vin 0 V- {V1}
Vep Vcc 0 {Vcc}
Ven 0 -Vcc {Vcc}
V1 Vin 0 SINE(0 {Vinpp/2} {fin})
RL Vo 0 {RL}
C1 N002 0 1000µ

* block symbol definitions
.subckt amplificador Vi+ Vcc -Vcc Vout Vi- V- V+
R1 -Vcc N032 {ReFte}
R2 -Vcc N033 {ReFte}
Q1 Vvas N030 N031 0 MPSA06
R3 N031 -Vcc 10
Q2 N026 N024 N022 0 MPSA56
Q3 N029 Vi- N023 0 MPSA56
Q4 N026 N029 N033 0 MPSA06
Q5 N029 N029 N032 0 MPSA06
R6 N014 N023 {ReDif}
R7 N022 N014 {ReDif}
Q6 N014 N004 N003 0 MPSA56
Q7 N005 N001 Vcc 0 MPSA56
Q8 N006 N005 N002 0 MPSA56
C1 Vcc N004 47µ
C2 V+ N008 47µ
R8 Vcc N003 47
R9 N002 N001 2.2k
R10 N002 Vcc 68
R11 0 N008 10k
R12 N008 N005 10k
R13 N004 N005 2.2k
R15 N024 0 {Rr1}
C3 N024 Vi+ {Cacop}
Q10 0 N026 N030 0 MPSA06
R16 N030 -Vcc 2.2k
Ccomp1 Vvas N026 {Ccomp}
Q11 Vcc N013 N015 0 mje340
Q12 N010 N015 N017 0 2SC3281
Q13 Vcc N009 N010 0 2SC3281
Q14 Vcc N007 N009 0 mje340
R18 N017 Vout 0.1
R19 Vout N019 0.1
Q15 N025 N020 N019 0 2SA1302
Q16 -Vcc N021 N020 0 mje350
Q17 -Vcc N027 N025 0 2SA1302
Q18 -Vcc N028 N027 0 mje350
R20 N015 N020 200
R22 N025 N027 100
R23 N009 N010 100
D3 N028 Vvas 1N4148
D4 N006 N007 1N4148
Q19 N012 N016 N018 0 mje340
R24 N013 N012 100
R25 N021 N018 100
R26 N011 N012 10
R27 N011 N016 3.3k
R28 N016 N018 1.72k
C7 N012 N018 22n
D5 N006 N011 1N4148
D6 N018 Vvas 1N4148
D1 V+ N010 DN5822
D2 N025 V- DN5822
C5 Vcc N007 220p
C6 N028 -Vcc 220p
.param ReDif=100 ReFte=68
.param Rr1=12k Rr2=470
.param Ccomp=470p Cacop=10u
.MODEL 1N4728 D( IS=15N N=2.22 BV=3.3 IBV=76M
+      RS=169M CJO=4P VJ=750M M=330M FC=500M
+      TT=100N EG=1.11 XTI=3 KF=0 AF=1
+      )
.MODEL BZX792V7 D(RS=14.877 BV=2.4025
+ CJO=687.46P TT=50N M=.33 VJ=.75 IS=1.0E-10 N=1.27 IBV=5MA)
.MODEL tip41c npn
+IS=7.55826e-11 BF=260.542 NF=1.11221 VAF=100
+IKF=0.526814 ISE=1e-08 NE=2.18072 BR=26.0542
+NR=1.5 VAR=1000 IKR=3.54059 ISC=1e-08
+NC=1.63849 RB=4.56157 IRB=0.1 RBM=0.1
+RE=0.0162111 RC=0.0810556 XTB=0.1 XTI=1
+EG=1.206 CJE=1.93296e-10 VJE=0.4 MJE=0.259503
+TF=1e-08 XTF=4.06972 VTF=7.1157 ITF=0.001
+CJC=1.09657e-10 VJC=0.730921 MJC=0.23 XCJC=0.803085
+FC=0.8 CJS=0 VJS=0.75 MJS=0.5
+TR=9.01013e-08 PTF=0 KF=0 AF=1
.MODEL tip42c pnp
+IS=5.65618e-10 BF=120.073 NF=1.24004 VAF=90.6071
+IKF=1.46498 ISE=6.98929e-14 NE=4 BR=2.83268
+NR=1.30331 VAR=27.1221 IKR=10 ISC=6.98934e-14
+NC=3.78125 RB=4.71382 IRB=0.234602 RBM=0.12691
+RE=0.000666374 RC=0.0927424 XTB=3.21145 XTI=1
+EG=1.05 CJE=1.93221e-10 VJE=0.4 MJE=0.259369
+TF=9.99163e-09 XTF=4.41941 VTF=6.53488 ITF=0.001
+CJC=1.0962e-10 VJC=0.731968 MJC=0.23 XCJC=0.799902
+FC=0.799995 CJS=0 VJS=0.75 MJS=0.5
+TR=1e-07 PTF=0 KF=0 AF=1
*SRC=1N5822;DN5822;Diodes;Schottky;40V 3A
.MODEL DN5822 D (IS=218U N=1.45 BV=4.00E+01 IBV=100E-06
+ RS=2.71E-02 CJO=4.39E-10 VJ=4.462 M=.699 TT=2.16E-11 XTI=2 EG=.69)
*  40 Volt   3.00 Amp   Si Schottky   Diode  07-23-1990
.model 2sc3281 npn IS=229.07p BF=135 NF=1.257 VAF=50 IKF=20
+ ISE=5.222p NE=1.392 BR=1 NR=1.411 VAR=75 NC=2 RB=4 RE=2m
+ RC=0.0389 CJE=6050p VJE=0.75 MJE=0.234 TF=5.3n XTF=0.4
+ ITF=4 CJC=440.35p VJC=0.75 MJC=0.233 TR=3.6e-8 XTB=1.08
+ VCEO=200V ICrating=15A MFG=Toshiba
.MODEL 2SA1302 PNP (IS=21.479p BF=136.48 VAF=100 IKF=19.980 ISE=21.504p
+ NE=1.3784 BR=329.48 VAR=100 IKR=19.980 ISC=4.3670n NC=1.4264 NK=.72845
+ RC=93.301m CJE=755.31p MJE=.33333 CJC=1.1417n MJC=.33333 TF=1.2802n
+ XTF=10 VTF=10 ITF=1 TR=10.000n Vceo=200 Icrating=15 mfg=Japan)
.MODEL mje340 NPN(IS=1.03431e-13 BF=172.974 NF=0.939811 VAF=27.3487
+IKF=0.0260146 ISE=4.48447e-11 NE=1.61605 BR=16.6725 NR=0.796984
+VAR=6.11596 IKR=0.10004 ISC=9.99914e-14 NC=1.99995 RB=1.47761 IRB=0.2
+RBM=1.47761 RE=0.0001 RC=1.42228 XTB=2.70726 XTI=1 EG=1.206 CJE=1e-11
+VJE=0.75 MJE=0.33 TF=1e-09 XTF=1 VTF=10 ITF=0.01 CJC=1e-11 VJC=0.75
+MJC=0.33 XCJC=0.9 FC=0.5 CJS=0 VJS=0.75 MJS=0.5 TR=1e-07 PTF=0
+Vceo=300 Icrating=0.5A mfg=OnSemi)
.MODEL mje350 PNP(IS=6.01619f BF=157.387 NF=0.910131 VAF=23.273
+IKF=0.0564808 ISE=4.48479p NE=1.58557 BR=0.1 NR=1.03823 VAR=4.14543
+IKR=0.0999978 ISC=1.00199e-13 NC=1.98851 RB=0.1 IRB=0.202965 RBM=0.1
+RE=0.0710678 RC=0.355339 XTB=1.03638 XTI=3.8424 EG=1.206 CJE=1e-11
+VJE=0.75 MJE=0.33 TF=1e-09 XTF=1 VTF=10 ITF=0.01 CJC=1e-11 VJC=0.75
+MJC=0.33 XCJC=0.9 FC=0.5 CJS=0 VJS=0.75 MJS=0.5 TR=1e-07 PTF=0
+Vceo=300 Icrating=0.5A mfg=OnSemi)
.MODEL MPSA56  PNP (
+ IS=120.32E-15
+ BF=188.84
+ VAF=100
+ IKF=2.8075
+ ISE=135.83E-15
+ NE=1.4750
+ BR=24.295
+ VAR=100
+ IKR=2.3092
+ ISC=703.00E-15
+ NC=1.6487
+ NK=1.3505
+ RB=1.9849
+ RC=24.680E-3
+ CJE=96.427E-12
+ VJE=.83382
+ MJE=.41469
+ CJC=52.708E-12
+ VJC=1.2213
+ MJC=.57874
+ TF=620.18E-12
+ XTF=49.825
+ VTF=22.355
+ ITF=.93852
+ TR=10.000E-9)
.MODEL MPSA06 npn
+IS=6.03149e-15 BF=559.138 NF=0.841146 VAF=996.086
+IKF=0.187838 ISE=1e-08 NE=3.53096 BR=43.984
+NR=0.893292 VAR=1.45264 IKR=1e-05 ISC=3.06474e-11
+NC=3.98114 RB=0.01 IRB=0.269152 RBM=0.01
+RE=1e-05 RC=0.000928752 XTB=1.17305 XTI=1
+EG=1.05 CJE=5.54912e-11 VJE=0.577764 MJE=0.313139
+TF=5.4629e-10 XTF=23.7458 VTF=7.07849 ITF=4.69733
+CJC=1.76218e-11 VJC=0.4 MJC=0.285166 XCJC=0.902334
+FC=0.732277 CJS=0 VJS=0.75 MJS=0.5
+TR=1e-07 PTF=0 KF=0 AF=1
.model lm385 D(Vfwd=.4 Vrev=1.235 Ilimit=10m Revilimit=30m Rrev=0.6)
.ends amplificador

.model D D
.lib standard.dio
.model NPN NPN
.model PNP PNP
.lib standard.bjt
.param N_cycles_show=20 N_cycles_wait=10
.param Vinpp=2 fin=10k
.param V1=15 Vcc=30
.param RL=8
.step param Vinpp list 0.16 0.24 0.36 0.668 1.05 1.88 2
.tran 0 {(N_cycles_wait+N_cycles_show)/fin} {N_cycles_wait/fin} {1/(fin*10e3)}
.four {fin} 9 {N_cycles_show} V(Vo)
.OPTIONS plotwinsize=0 numdgt=15
.option noopiter
.meas TRAN P_carga AVG V(vo)*I(RL) FROM 0
.backanno
.end